# EAGLE design monulator-arm-lpc11u (EAGLE 5.12)
REVISION: 20130127
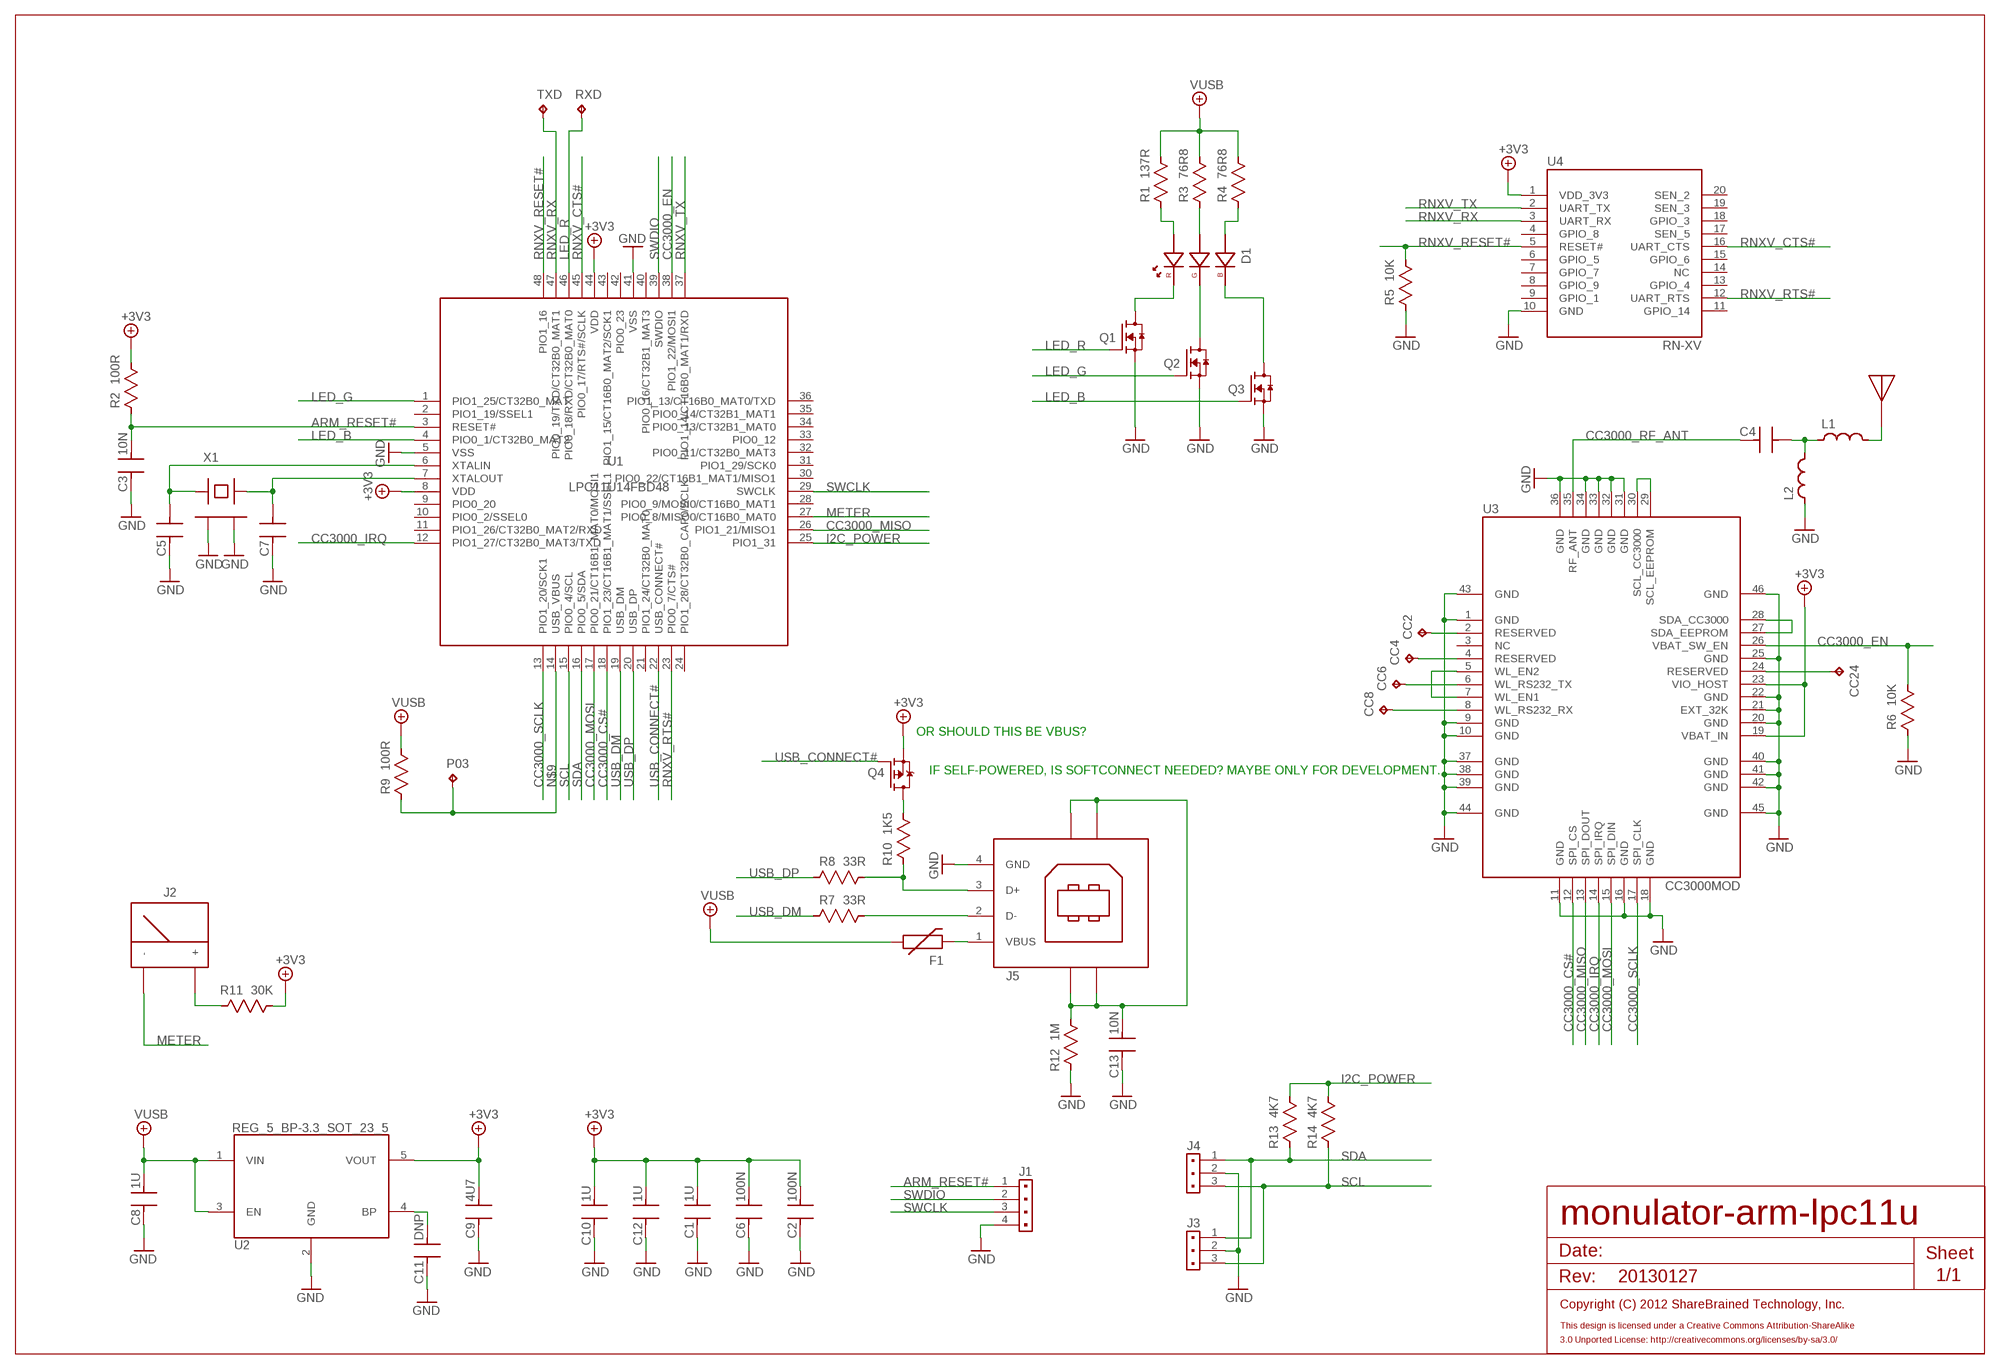
[diagram p0: schematic, sheet 1]

## Parts
A1  2450AT43A100  [2450AT43A100]
C1  1U  C0603_90  [CAPC1608X90N]
C2  100N  C0603_90  [CAPC1608X90N]
C3  10N  C0603_90  [CAPC1608X90N]
C4  C0402_55  [CAPC1005X55N]
C5  C0603_90  [CAPC1608X90N]
C6  100N  C0603_90  [CAPC1608X90N]
C7  C0603_90  [CAPC1608X90N]
C8  1U  C0603_90  [CAPC1608X90N]
C9  4U7  C0603_90  [CAPC1608X90N]
C10  1U  C0603_90  [CAPC1608X90N]
C11  DNP  C0603_90  [CAPC1608X90N]
C12  1U  C0603_90  [CAPC1608X90N]
C13  10N  C0603_90  [CAPC1608X90N]
CC2  TPB1,27  [B1,27]
CC4  TPB1,27  [B1,27]
CC6  TPB1,27  [B1,27]
CC8  TPB1,27  [B1,27]
CC24  TPB1,27  [B1,27]
D1  LED_RGB_5060_6  [RGB_LED5060_6]
F1  FUSE_BOURNS_MF-NSMF050  [BOURNS_MF-NSMF]
J1  HEADER1X4TH-200  [HEADER200P1X4]
J2  METERETONNET_85C1  [ETONNET_85C1]
J3  HEADER1X3TH-254  [HEADER254P1X3]
J4  HEADER1X3TH-254  [HEADER254P1X3]
J5  USB_B_OST_USB-B1KS  [USB_B_VERTICAL]
L1  L0402_60  [INDC1005X60N]
L2  L0402_60  [INDC1005X60N]
P03  TPB1,27  [B1,27]
Q1  DMN2075U-7  [SOT95P237X117-3N]
Q2  DMN2075U-7  [SOT95P237X117-3N]
Q3  DMN2075U-7  [SOT95P237X117-3N]
Q4  DMP2004K  [SOT95P237X117-3N]
R1  137R  R0603_55  [RESC1608X55N]
R2  100R  R0603_55  [RESC1608X55N]
R3  76R8  R0603_55  [RESC1608X55N]
R4  76R8  R0603_55  [RESC1608X55N]
R5  10K  R0603_55  [RESC1608X55N]
R6  10K  R0603_55  [RESC1608X55N]
R7  33R  R0603_55  [RESC1608X55N]
R8  33R  R0603_55  [RESC1608X55N]
R9  100R  R0603_55  [RESC1608X55N]
R10  1K5  R0603_55  [RESC1608X55N]
R11  30K  R0603_55  [RESC1608X55N]
R12  1M  R0603_55  [RESC1608X55N]
R13  4K7  R0603_55  [RESC1608X55N]
R14  4K7  R0603_55  [RESC1608X55N]
RXD  TPB1,27  [B1,27]
TXD  TPB1,27  [B1,27]
U1  LPC11U14FBD48  [QFP50P900X900X160-48N]
U2  REG_5_BP-3.3_SOT_23_5  [SOT95P280X110-5N]
U3  CC3000MOD  [CC3000MOD]
U4  RN-XV  [RN-XV]
X1  X_CASE2_NDK_NX3225SA  [OSCCC250X320X70-4N]

## Nets
+3V3: C1.2 C2.2 C6.2 C9.2 C10.2 C12.2 Q4.2(S) R2.2 R11.2 U1.8(VDD) U1.44(VDD) U2.5(VOUT) U3.19(VBAT_IN) U3.23(VIO_HOST) U4.1(VDD_3V3)
ARM_RESET#: C3.2 J1.1 R2.1 U1.3(RESET#)
CC3000_CS#: U1.18(PIO1_23/CT16B1_MAT1/SSEL1) U3.12(SPI_CS)
CC3000_EN: R6.2 U1.38(PIO1_22/MOSI1) U3.26(VBAT_SW_EN)
CC3000_IRQ: U1.12(PIO1_27/CT32B0_MAT3/TXD) U3.14(SPI_IRQ)
CC3000_MISO: U1.26(PIO1_21/MISO1) U3.13(SPI_DOUT)
CC3000_MOSI: U1.17(PIO0_21/CT16B1_MAT0/MOSI1) U3.15(SPI_DIN)
CC3000_RF_ANT [50ohm]: C4.1 U3.35(RF_ANT)
CC3000_SCLK: U1.13(PIO1_20/SCK1) U3.17(SPI_CLK)
GND: C1.1 C2.1 C3.1 C5.1 C6.1 C7.1 C8.1 C9.1 C10.1 C11.1 C12.1 C13.1 J1.4 J3.2 J4.2 J5.4(GND) L2.1 Q1.2(S) Q2.2(S) Q3.2(S) R5.1 R6.1 R12.1 U1.5(VSS) U1.41(VSS) U2.2(GND) U3.1(GND) U3.9(GND) U3.10(GND) U3.11(GND) U3.16(GND) U3.18(GND) U3.20(GND) U3.21(EXT_32K) U3.22(GND) U3.25(GND) U3.31(GND) U3.32(GND) U3.33(GND) U3.34(GND) U3.36(GND) U3.37(GND) U3.38(GND) U3.39(GND) U3.40(GND) U3.41(GND) U3.42(GND) U3.43(GND) U3.44(GND) U3.45(GND) U3.46(GND) U4.10(GND) X1.2(CASE) X1.4(CASE)
I2C_POWER: R13.2 R14.2 U1.25(PIO1_31)
LED_B: Q3.1(G) U1.4(PIO0_1/CT32B0_MAT2)
LED_G: Q2.1(G) U1.1(PIO1_25/CT32B0_MAT)
LED_R: Q1.1(G) RXD.TP U1.46(PIO0_18/RXD/CT32B0_MAT0)
METER: J2.- U1.27(PIO0_8/MISO0/CT16B0_MAT0)
N$1: D1.1(A_R) R1.1
N$2: D1.6(C_R) Q1.3(D)
N$3: D1.3(A_B) R4.1
N$6 [usb]: J5.2(D-) R7.2
N$7 [usb]: J5.3(D+) R8.2 R10.1
N$8: C13.2 J5.SHIELD@1(SHIELD) J5.SHIELD@2(SHIELD) J5.SHIELD@3(SHIELD) J5.SHIELD@4(SHIELD) R12.2
N$9: P03.TP R9.1 U1.14(USB_VBUS)
N$10: C11.2 U2.4(BP)
N$11: D1.5(C_G) Q2.3(D)
N$12: D1.4(C_B) Q3.3(D)
N$13: D1.2(A_G) R3.1
N$16: U3.29(SCL_EEPROM) U3.30(SCL_CC3000)
N$17: C7.2 U1.7(XTALOUT) X1.3
N$18: C5.2 U1.6(XTALIN) X1.1
N$20: Q4.3(D) R10.2
N$21: U3.27(SDA_EEPROM) U3.28(SDA_CC3000)
N$34: CC4.TP U3.4(RESERVED)
N$35: CC2.TP U3.2(RESERVED)
N$36: CC8.TP U3.8(WL_RS232_RX)
N$37: CC6.TP U3.6(WL_RS232_TX)
N$38: U3.5(WL_EN2) U3.7(WL_EN1)
N$39: CC24.TP U3.24(RESERVED)
N$41: J2.+ R11.1
N$43 [50ohm]: C4.2 L1.1 L2.2
N$44 [50ohm]: A1.1 L1.2
RNXV_CTS#: U1.45(PIO0_17/RTS#/SCLK) U4.16(UART_CTS)
RNXV_RESET#: R5.2 U1.48(PIO1_16) U4.5(RESET#)
RNXV_RTS#: U1.23(PIO0_7/CTS#) U4.12(UART_RTS)
RNXV_RX: TXD.TP U1.47(PIO0_19/TXD/CT32B0_MAT1) U4.3(UART_RX)
RNXV_TX: U1.37(PIO1_14/CT16B0_MAT1/RXD) U4.2(UART_TX)
SCL: J3.3 J4.3 R14.1 U1.15(PIO0_4/SCL)
SDA: J3.1 J4.1 R13.1 U1.16(PIO0_5/SDA)
SWCLK: J1.3 U1.29(SWCLK)
SWDIO: J1.2 U1.39(SWDIO)
USB_CONNECT#: Q4.1(G) U1.22(USB_CONNECT#)
USB_DM [usb]: R7.1 U1.19(USB_DM)
USB_DP [usb]: R8.1 U1.20(USB_DP)
VBUS_RAW: F1.2 J5.1(VBUS)
VUSB: C8.2 F1.1 R1.2 R3.2 R4.2 R9.2 U2.1(VIN) U2.3(EN)
Unconnected: U1.2(PIO1_19/SSEL1) U1.9(PIO0_20) U1.10(PIO0_2/SSEL0) U1.11(PIO1_26/CT32B0_MAT2/RXD) U1.21(PIO1_24/CT32B0_MAT0) U1.24(PIO1_28/CT32B0_CAP0/SCLK) U1.28(PIO0_9/MOSI0/CT16B0_MAT1) U1.30(PIO0_22/CT16B1_MAT1/MISO1) U1.31(PIO1_29/SCK0) U1.32(PIO0_11/CT32B0_MAT3) U1.33(PIO0_12) U1.34(PIO0_13/CT32B1_MAT0) U1.35(PIO0_14/CT32B1_MAT1) U1.36(PIO1_13/CT16B0_MAT0/TXD) U1.40(PIO0_16/CT32B1_MAT3) U1.42(PIO0_23) U1.43(PIO1_15/CT16B0_MAT2/SCK1) U3.3(NC) U4.4(GPIO_8) U4.6(GPIO_5) U4.7(GPIO_7) U4.8(GPIO_9) U4.9(GPIO_1) U4.11(GPIO_14) U4.13(GPIO_4) U4.14(NC) U4.15(GPIO_6) U4.17(SEN_5) U4.18(GPIO_3) U4.19(SEN_3) U4.20(SEN_2)

## Notes on the sheet
- OR SHOULD THIS BE VBUS?
- IF SELF-POWERED, IS SOFTCONNECT NEEDED? MAYBE ONLY FOR DEVELOPMENT...

## Library data of the parts
A1 = johanson:2450AT?*
C1-C13 = capacitor:C
CC2 CC4 CC6 CC8 CC24 P03 RXD TXD = testpad:TP: Test pad
D1 = led:LED_RGB
F1 = fuse:FUSE?*
J1 = stake:HEADER1X4
J2 = meters:METER
J3 J4 = stake:HEADER1X3
J5 = usb:USB_B
L1 L2 = inductor:L
Q1-Q3 = mosfet:DMN2075U
Q4 = mosfet:DMP2004K
R1-R14 = resistor:R
U1 = nxp:LPC11U1*?
U2 = regulator:REG_5_BP-*
U3 = ti:CC3000MOD
U4 = microchip:RN-XV
X1 = crystal:X_CASE2

## Net classes
1 usb: width 0.9 mm, clearance 0.6 mm
2 50ohm: width 0.6 mm, clearance 0.7 mm

## Board
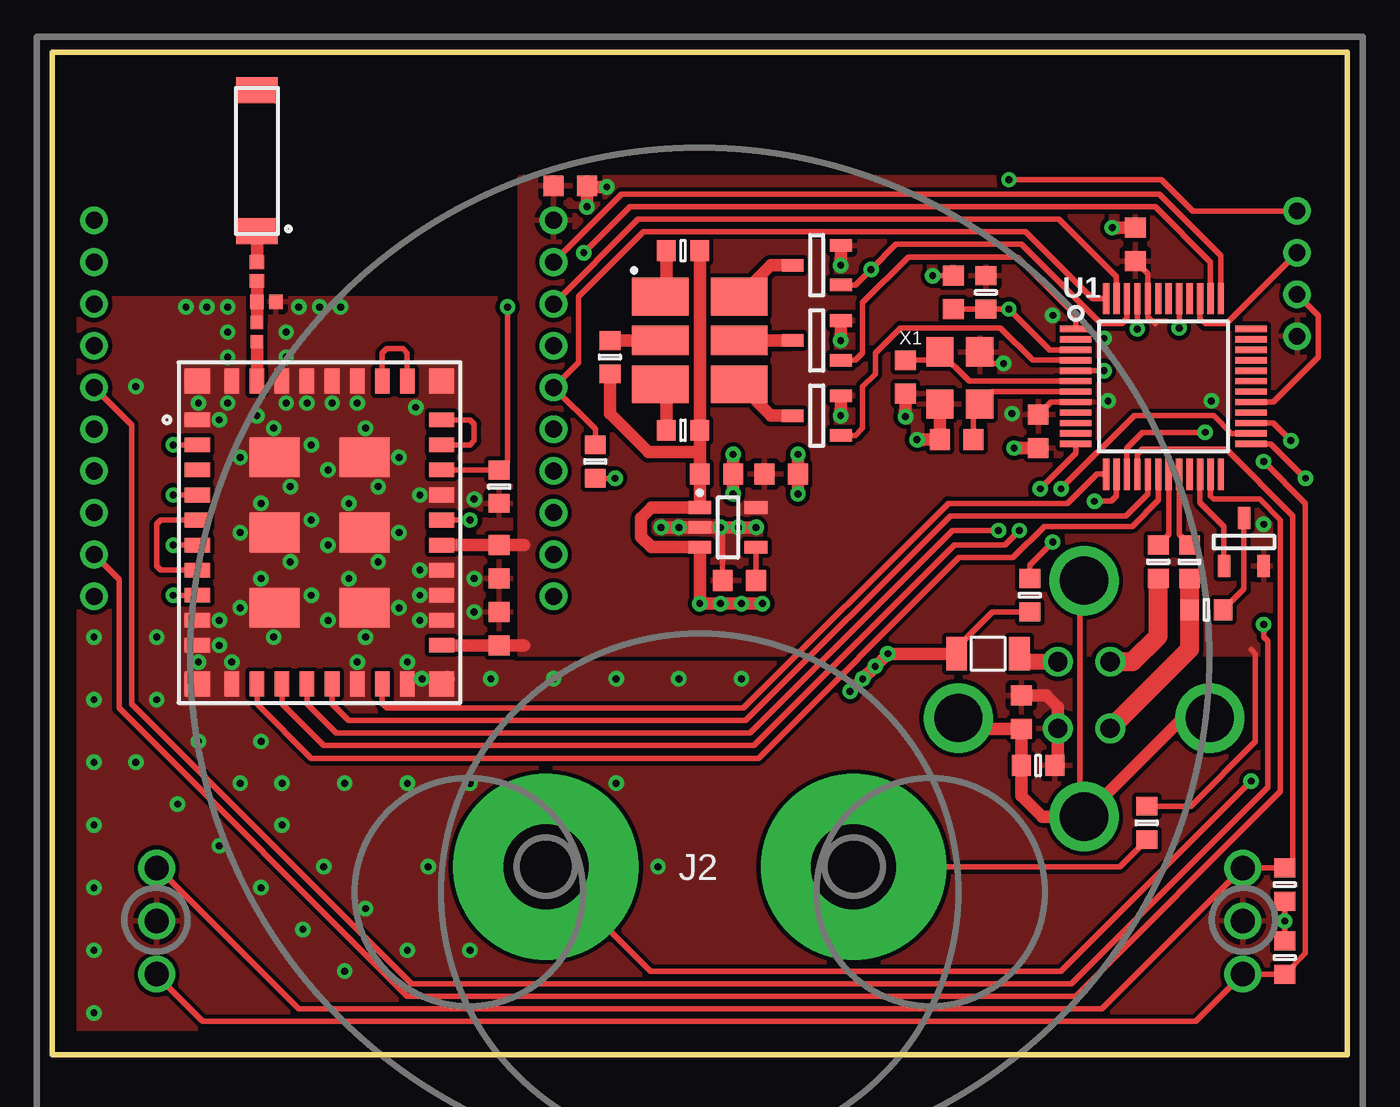
[diagram p1: board, top side]
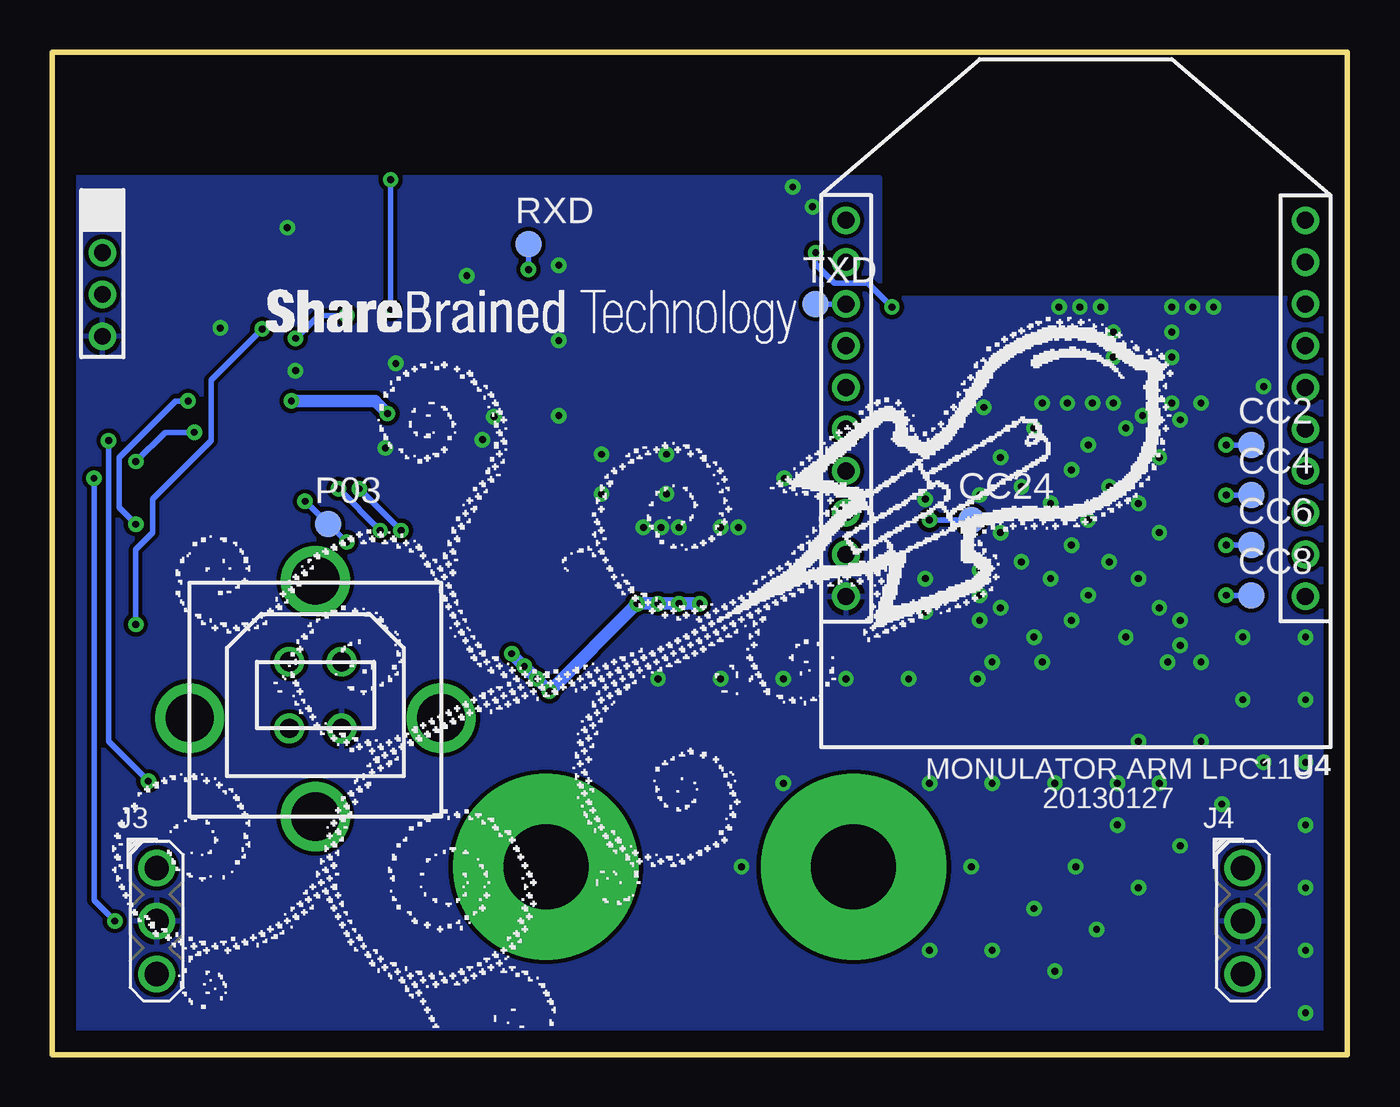
[diagram p2: board, bottom side, seen from below]

Size 62 x 48 mm. Coordinates in mm from the lower left corner, seen from the top.
Outline: 0,0 62,0 62,48 0,48 0,0
Copper layers (1*16): Top 0.035mm / dielectric 1.5mm / Bottom 0.035mm
Design rules "default *": minimum track width 10mil, minimum drill 13mil, track to track 8mil, track to pad 8mil, pad to pad 8mil, via to via 8mil, smd to smd 8mil, copper to edge 40mil, drill to drill 8mil, minimum pad ring 10mil, minimum via ring 8mil, stop-mask expansion 4mil, vias tented up to drill 13mil, thermal gap 10mil

### Footprints (pad centres in the part's own frame; a part is rotated, then mirrored left to right if it is on the bottom)
2450AT43A100 = smd 1.25 x 2: 1 -3.375,0; 2 3.375,0
CAPC1608X90N = smd 0.95 x 1: 1 -0.8,0; 2 0.8,0
CAPC1005X55N = smd 0.62 x 0.62: 1 -0.45,0; 2 0.45,0
B1,27 = smd 1.27 x 1.27: TP 0,0
RGB_LED5060_6 = smd 2.7 x 1.8: 1 -1.9,2.1; 3 -1.9,-2.1; 4 1.9,-2.1; 6 1.9,2.1 | smd 2.7 x 1.4: 2 -1.9,0; 5 1.9,0
BOURNS_MF-NSMF = smd 1 x 1.6: 1 -1.5,0; 2 1.5,0
HEADER200P1X4 = drill 0.8 round: 1 0,3; 2 0,1; 3 0,-1; 4 0,-3
ETONNET_85C1 = drill 4.064 pad 8.89 round: + 7.366,0; - -7.366,0
HEADER254P1X3 = drill 1.168 round: 1 0,2.54; 2 0,0; 3 0,-2.54
USB_B_VERTICAL = drill 0.92 round: 1 1.25,1.82; 2 -1.25,1.82; 3 -1.25,-1.38; 4 1.25,-1.38 | drill 2.3 round: SHIELD@1 -6.02,-0.88; SHIELD@2 6.02,-0.88; SHIELD@3 0,5.7; SHIELD@4 0,-5.6
INDC1005X60N = smd 0.65 x 0.7: 1 -0.45,0; 2 0.45,0
SOT95P237X117-3N = smd 1.05 x 0.6: 1 -1.15,0.95; 2 -1.15,-0.95; 3 1.15,0
RESC1608X55N = smd 0.9 x 1: 1 -0.8,0; 2 0.8,0
QFP50P900X900X160-48N = smd 1.5 x 0.3: 1 -4.2,2.75; 2 -4.2,2.25; 3 -4.2,1.75; 4 -4.2,1.25; 5 -4.2,0.75; 6 -4.2,0.25; 7 -4.2,-0.25; 8 -4.2,-0.75; 9 -4.2,-1.25; 10 -4.2,-1.75; 11 -4.2,-2.25; 12 -4.2,-2.75; 25 4.2,-2.75; 26 4.2,-2.25; 27 4.2,-1.75; 28 4.2,-1.25; 29 4.2,-0.75; 30 4.2,-0.25; 31 4.2,0.25; 32 4.2,0.75; 33 4.2,1.25; 34 4.2,1.75; 35 4.2,2.25; 36 4.2,2.75 | smd 0.3 x 1.5: 13 -2.75,-4.2; 14 -2.25,-4.2; 15 -1.75,-4.2; 16 -1.25,-4.2; 17 -0.75,-4.2; 18 -0.25,-4.2; 19 0.25,-4.2; 20 0.75,-4.2; 21 1.25,-4.2; 22 1.75,-4.2; 23 2.25,-4.2; 24 2.75,-4.2; 37 2.75,4.2; 38 2.25,4.2; 39 1.75,4.2; 40 1.25,4.2; 41 0.75,4.2; 42 0.25,4.2; 43 -0.25,4.2; 44 -0.75,4.2; 45 -1.25,4.2; 46 -1.75,4.2; 47 -2.25,4.2; 48 -2.75,4.2
SOT95P280X110-5N = smd 1.1 x 0.6: 1 -1.35,0.95; 2 -1.35,0; 3 -1.35,-0.95; 4 1.35,-0.95; 5 1.35,0.95
CC3000MOD = smd 1.2 x 0.7: 1 -5.85,5.4; 2 -5.85,4.2; 3 -5.85,3; 4 -5.85,1.8; 5 -5.85,0.6; 6 -5.85,-0.6; 7 -5.85,-1.8; 8 -5.85,-3; 9 -5.85,-4.2; 10 -5.85,-5.4; 19 5.85,-5.4; 20 5.85,-4.2; 21 5.85,-3; 22 5.85,-1.8; 23 5.85,-0.6; 24 5.85,0.6; 25 5.85,1.8; 26 5.85,3; 27 5.85,4.2; 28 5.85,5.4 | smd 0.7 x 1.2: 11 -4.2,-7.25; 12 -3,-7.25; 13 -1.8,-7.25; 14 -0.6,-7.25; 15 0.6,-7.25; 16 1.8,-7.25; 17 3,-7.25; 18 4.2,-7.25; 29 4.2,7.25; 30 3,7.25; 31 1.8,7.25; 32 0.6,7.25; 33 -0.6,7.25; 34 -1.8,7.25; 35 -3,7.25; 36 -4.2,7.25 | smd 2.4 x 1.9: 37 -2.15,3.6; 38 -2.15,0; 39 -2.15,-3.6; 40 2.15,3.6; 41 2.15,0; 42 2.15,-3.6 | smd 1.2 x 1.2: 43 -5.85,7.25; 44 -5.85,-7.25; 45 5.85,-7.25; 46 5.85,7.25
RN-XV = drill 0.813 round: 1 -11,8.75; 2 -11,6.75; 3 -11,4.75; 4 -11,2.75; 5 -11,0.75; 6 -11,-1.25; 7 -11,-3.25; 8 -11,-5.25; 9 -11,-7.25; 10 -11,-9.25; 11 11,-9.25; 12 11,-7.25; 13 11,-5.25; 14 11,-3.25; 15 11,-1.25; 16 11,0.75; 17 11,2.75; 18 11,4.75; 19 11,6.75; 20 11,8.75
OSCCC250X320X70-4N = smd 1.3 x 1.4: 1 -0.95,1.25; 2 -0.95,-1.25; 3 0.95,-1.25; 4 0.95,1.25

### Placement (x,y rotation side)
A1  9.8,42.8 90 top
C1  24.8,41.6 180 top
C2  51.85,38.8 270 top
C3  43.15,36.5 270 top
C4  9.8,34.6 90 top
C5  40.85,32.45 90 top
C6  47.2,29.85 90 top
C7  43.3,29.45 0 top
C8  31.8,27.8 180 top
C9  34.9,27.8 180 top
C10  21.4,23.6 90 top
C11  32.9,22.7 0 top
C12  21.4,20.4 270 top
C13  46.4,16.4 270 top
CC2  4.6,29.2 0 bottom
CC4  4.6,26.8 0 bottom
CC6  4.6,24.4 0 bottom
CC8  4.6,22 0 bottom
CC24  18,25.6 0 bottom
D1  31,34.2 0 top
F1  44.8,19.2 0 top
J1  59.6,37.4 0 bottom
J2  31,9 0 top
J3  57,6.4 0 bottom
J4  5,6.4 0 bottom
J5  49.4,17 0 bottom
L1  9.8,37.5 90 top
L2  10.25,36.05 180 top
P03  48.8,25.4 0 bottom
Q1  36.6,37.8 180 top
Q2  36.6,34.2 180 top
Q3  36.6,30.6 180 top
Q4  57.05,24.55 90 top
R1  30.2,38.5 0 top
R2  44.7,36.5 90 top
R3  26.7,33.4 270 top
R4  30.2,29.9 0 top
R5  26,28.4 90 top
R6  21.4,27.2 90 top
R7  52.95,23.6 270 top
R8  54.45,23.6 270 top
R9  46.8,22 270 top
R10  55.25,21.3 0 top
R11  52.4,11.1 90 top
R12  47.2,13.85 180 top
R13  59,8.15 270 top
R14  59,4.65 90 top
RXD  39.2,38.8 0 bottom
TXD  25.45,35.95 0 bottom
U1  53.2,32 0 top
U2  32.35,25.25 0 top
U3  12.8,25 0 top
U4  13,31.2 0 bottom
U$2  [LOGO_BULB_SWIRL_2000_250]  35,18.2 0 bottom
U$3  [NAME_1000_500]  39.6,35.4 0 bottom
X1  43.45,32.4 0 top

### Tracks (layer width: path | path; a pad name or v marks a point on that pad's centre or on a via)
+3V3  (via drill 0.33)
  Top 0.254: U1.8 47.8,31.25 C6.2 | C2.2 52.45,37.4 U1.44 52.45,35.35 52.8,35 | R11.2 54.5,11.9 57.6,15 57.6,19.2 57.4,19.4
  Top 0.6: U3.23 C10.2 22.6,24.4 | U3.19 C12.2 22.6,19.6
  Bottom 0.254: v55.5,31.3 56.1,31.3 58.8,28.6 58.8,26.2 v58,25.4 | v47.9,35.4 49.25,35.4 v50.35,34.3
  Bottom 0.6: v50.55,31.3 46.55,31.3 v45.95,30.7
  pour Top: 22.4,19.2 22.4,42 62,42 62,19.2
ARM_RESET#  (via drill 0.33)
  Top 0.254: U1.3 47.75,33.75 v45.8,35.7 R2.1 C3.2 | v45.8,41.9 53.1,41.9 54.6,40.4 J1.1
  Bottom 0.254: v45.8,35.7 v45.8,41.9
CC3000_CS#
  Top 0.254: U1.18 52.95,26.55 51.7,25.3 47.5,25.3 46,23.8 43.4,23.8 33.8,14.2 12.4,14.2 9.8,16.8 U3.12
CC3000_EN  (via drill 0.33)
  Top 0.254: U3.26 R6.2 21.8,28.4 v21.8,35.8 | v25.45,38.4 27.65,40.6 52.8,40.6 55.45,37.95 U1.38
  Bottom 0.254: v21.8,35.8 22.95,36.95 24.55,36.95 25.45,37.85 v25.45,38.4
CC3000_IRQ  (via drill 0.33)
  Top 0.254: U3.14 12.2,16.8 13.6,15.4 33.4,15.4 43.1,25.1 v45.3,25.1 | v47.3,27.1 49,28.8 U1.12
  Bottom 0.254: v45.3,25.1 v47.3,27.1
CC3000_MISO  (via drill 0.33)
  Top 0.254: U3.13 11,16.8 13,14.8 33.6,14.8 43.2,24.4 45.6,24.4 v46.3,25.1 | v48.3,27.1 51.8,30.6 55.6,30.6 56.45,29.75 U1.26
  Bottom 0.254: v46.3,25.1 v48.3,27.1
CC3000_MOSI
  Top 0.254: U1.17 52.45,26.85 51.4,25.8 43,25.8 33.2,16 14.2,16 13.4,16.8 U3.15
CC3000_RF_ANT
  Top 0.6: U3.35 C4.1
CC3000_SCLK
  Top 0.254: U1.13 50,27.8 48.6,26.4 42.9,26.4 33.1,16.6 16,16.6 15.8,16.8 U3.17
GND  (via drill 0.33)
  Top 0.254: U1.41 v53.95,34.8 | C11.1 32.1,25.15 v32,25.25 | R5.1 v26.95,27.6 | U1.5 v50.35,32.75 | X1.4 44.95,33.1 v45.55,33.1 | C3.1 v42.15,37.3
  Top 0.6: Q3.2 v37.75,30.6 | v37.75,34.2 Q2.2 | Q1.2 v37.75,37.8 | C6.1 v46.05,29.05 | C5.1 v40.85,30.55 | v41.4,29.45 C7.1 X1.2 | v50.75,39.6 C2.1 | v32.6,26.85 C8.1 v32.6,28.75 | v33.7,25.25 v32.85,25.25 v32,25.25 U2.2 v30,25.25 v29.15,25.25 | v35.7,28.75 C9.1 35.7,26.9 | C1.1 25.6,41.55 | 25.6,41.55 v25.6,40.6 | 25.6,41.55 v26.55,41.55 | C13.1 47.6,17.2 48.15,16.65 J5.4 48.15,14 R12.1
  Top 0.762: U3.45 18.9,18
  other vias: 8.4,31.2 11.2,31.2 14.6,31.2 17.4,31 17.6,26.8 17.6,23.2 17.6,20.8 17,18.8 8,19.6 8,20.8 12.4,22 10,22.8 10.6,20 14.2,22.8 14.6,18.8 15.6,27.2 11.4,27.2 12.4,29.2 12.4,25.6 9,28.6 9,25 9,21.4 16.6,21.4 16.6,25 16.6,28.6 15,20 10.6,30 15,30 12.2,31.2 13.4,31.2 7,31.2 8,30.4 8.6,18.8 7,18.8 17.6,22 13.2,28 10,26.4 14.2,26.4 13.2,24.4 11.4,23.6 15.6,23.6 13.2,20.8 11.8,35.8 11.2,34.6 11.2,33.4 8.4,33.4 8.4,34.6 8.4,35.8 7.4,35.8 6.4,35.8 12.8,35.8 13.8,35.8 9.8,30.6 20.2,26.6 17.7,18 21,18 35.7,26.85 20.2,22.8 20.2,21.2 20,13 17,13 14,13 11,13 10,15 5,17 5,20 4,32 7,15 9,13 11,11 13,9 15,7 17,5 2,20 2,17 2,14 2,11 2,8 2,5 2,2 14,4 12,6 10,8 8,10 6,12 4,14 20,5 18,9 29,9 27,13 24,18 27,18 33,18 30,18
  pour Bottom: 0,0 0,36.2 22.4,36.2 22.4,42 62,42 62,0
  pour Top (rank 2): 0,36.2 22.4,36.2 22.4,42 62,42 62,0 0,0
I2C_POWER  (via drill 0.33)
  Top 0.254: U1.25 58.35,29.25 v60,27.6 | R13.2 v59,6.4 R14.2
  Bottom 0.254: v60,27.6 60,7.4 v59,6.4
LED_B
  Top 0.254: Q3.1 38.45,29.65 38.8,30 38.8,32 39.4,32.6 39.4,33.6 40.6,34.8 45.4,34.8 46.95,33.25 U1.4
LED_G
  Top 0.254: Q2.1 38.45,33.25 38.8,33.6 38.8,36 41,38.2 46.2,38.2 49,35.4 U1.1
LED_R  (via drill 0.33)
  Top 0.254: U1.46 51.45,35.25 51.2,35 50.2,35 46.4,38.8 40.4,38.8 v39.2,37.6 38.45,36.85 Q1.1
  Bottom 0.254: v39.2,37.6 RXD.TP
METER  (via drill 0.33)
  Top 0.254: v59.3,29.4 58.45,30.25 U1.27 | v57.4,13.1 48.3,4 28.63,4 J2.-
  Bottom 0.254: v59.3,29.4 59.3,15 v57.4,13.1
N$1
  Top 0.6: R1.1 29.4,36.6 D1.1
N$2
  Top 0.6: Q1.3 34.4,37.8 D1.6
N$3
  Top 0.6: D1.3 29.4,31.8 R4.1
N$6
  Top 0.9: R7.2 52.95,20.05 51.72,18.82 J5.2
N$7
  Top 0.9: R8.2 R10.1 54.45,19.42 J5.3
N$8
  Top 0.254: J5.SHIELD@3 49.2,22.5 49.2,11.6 J5.SHIELD@4
  Top 0.6: J5.SHIELD@2 43.9,15.6 C13.2 R12.2 46.4,12.4 47.4,11.4 J5.SHIELD@4 54.12,16.12 J5.SHIELD@1
N$9  (via drill 0.33)
  Top 0.254: v49.9,26.5 50.7,26.5 50.95,26.75 U1.14 | R9.1 46.8,23.45 v47.9,24.55
  Bottom 0.254: v47.9,24.55 P03.TP v49.9,26.5
N$10
  Top 0.254: C11.2 U2.4
N$11
  Top 0.6: D1.5 Q2.3
N$12
  Top 0.6: Q3.3 34.4,30.6 D1.4
N$13
  Top 0.6: R3.1 D1.2
N$16
  Top 0.254: U3.30 15.8,33.6 16,33.8 16.8,33.8 17,33.6 U3.29
N$17
  Top 0.254: C7.2 44.1,30.85 X1.3 45,31.75 U1.7
N$18
  Top 0.254: C5.2 42.1,33.25 X1.1 43.9,32.25 U1.6
N$20
  Top 0.254: 55.9,21.6 R10.2 57.05,22.3 Q4.3
N$21
  Top 0.254: U3.28 20,30.4 20.2,30.2 20.2,29.4 20,29.2 U3.27
N$34  (via drill 0.33)
  Top 0.254: v5.8,26.8 U3.4
  Bottom 0.254: CC4.TP v5.8,26.8
N$35  (via drill 0.33)
  Top 0.254: v5.8,29.2 U3.2
  Bottom 0.254: CC2.TP v5.8,29.2
N$36  (via drill 0.33)
  Top 0.254: v5.8,22 U3.8
  Bottom 0.254: CC8.TP v5.8,22
N$37  (via drill 0.33)
  Top 0.254: v5.8,24.4 U3.6
  Bottom 0.254: CC6.TP v5.8,24.4
N$38
  Top 0.254: U3.5 5.2,25.6 5,25.4 5,23.4 5.2,23.2 U3.7
N$39  (via drill 0.33)
  Top 0.254: v20,25.6 U3.24
  Bottom 0.254: CC24.TP v20,25.6
N$41
  Top 0.254: J2.+ 51.1,9 R11.1
N$43
  Top 0.6: C4.2 L2.2 L1.1
N$44
  Top 0.6: A1.1 L1.2
RNXV_CTS#  (via drill 0.33)
  Top 0.254: U4.16 3.8,30.15 3.8,16.8 17.2,3.4 48.8,3.4 58.2,12.8 58.2,19.8 58,20 v58,20.6 | v51.95,34.75 U1.45
  Bottom 0.254: v58,20.6 58,24.2 57.2,25 57.2,26.6 54.4,29.4 54.4,32.3 v51.95,34.75
RNXV_RESET#
  Top 0.254: U1.48 49.8,36.2 46.6,39.4 28.3,39.4 25.2,36.3 25.2,33.15 U4.5 26,29.95 R5.2
RNXV_RTS#
  Top 0.254: U1.23 55.45,26.75 55.6,26.6 57.8,26.6 58.8,25.6 58.8,12.6 49,2.8 17,2.8 3.2,16.6 3.2,22.75 U4.12
RNXV_RX
  Top 0.254: U1.47 50.95,37.25 48.2,40 28.05,40 U4.3
  Bottom 0.254: U4.3 TXD.TP
RNXV_TX
  Top 0.254: U4.2 27.25,41.2 53,41.2 55.95,38.25 U1.37
SCL  (via drill 0.33)
  Top 0.254: v58,28.4 60,26.4 60,4.85 R14.1 J3.3 54.74,1.6 7.2,1.6 5,3.8 J4.3 | v55.2,29.8 52.2,29.8 51.45,29.05 U1.15
  Bottom 0.254: v55.2,29.8 56.6,29.8 v58,28.4
SDA
  Top 0.254: J4.1 5.06,8.94 11.8,2.2 50.26,2.2 J3.1 R13.1 59.4,9.35 59.4,25.8 56.2,29 52.2,29 51.95,28.75 U1.16
SWCLK
  Top 0.254: U1.29 58.45,31.25 60.6,33.4 60.6,35.4 J1.3
SWDIO
  Top 0.254: U1.39 54.95,35.25 55.2,35 56.2,35 J1.2
USB_CONNECT#
  Top 0.254: U1.22 54.95,26.45 56.1,25.3 Q4.1
USB_DM
  Top 0.254: U1.19 53.45,24.9 R7.1
USB_DP
  Top 0.254: U1.20 53.95,24.9 R8.1
VBUS_RAW
  Top 0.762: J5.1 46.68,18.82 F1.2
VUSB  (via drill 0.33)
  Top 0.254: R9.2 45,21.2 43.3,19.5 F1.1
  Top 0.6: R1.2 R4.2 31,28.85 | R3.2 26.7,30.7 28.55,28.85 31,28.85 | 31,28.85 C8.2 U2.1 28.7,26.2 28.2,25.7 28.2,24.8 28.7,24.3 U2.3 v31,21.6 v32,21.6 v33,21.6 v34,21.6 | F1.1 v40,19.2 v39.4,18.6 v38.8,18 v38.2,17.4
  Bottom 0.6: v31,21.6 v32,21.6 v33,21.6 v34,21.6 v38.2,17.4 v38.8,18 v39.4,18.6 v40,19.2

### Text on the board
bPlace: MONULATOR ARM LPC11U | 20130127